# EAGLE design controller_board (EAGLE 9.4.0)
Assembly variants: Minimal, FullAwesome
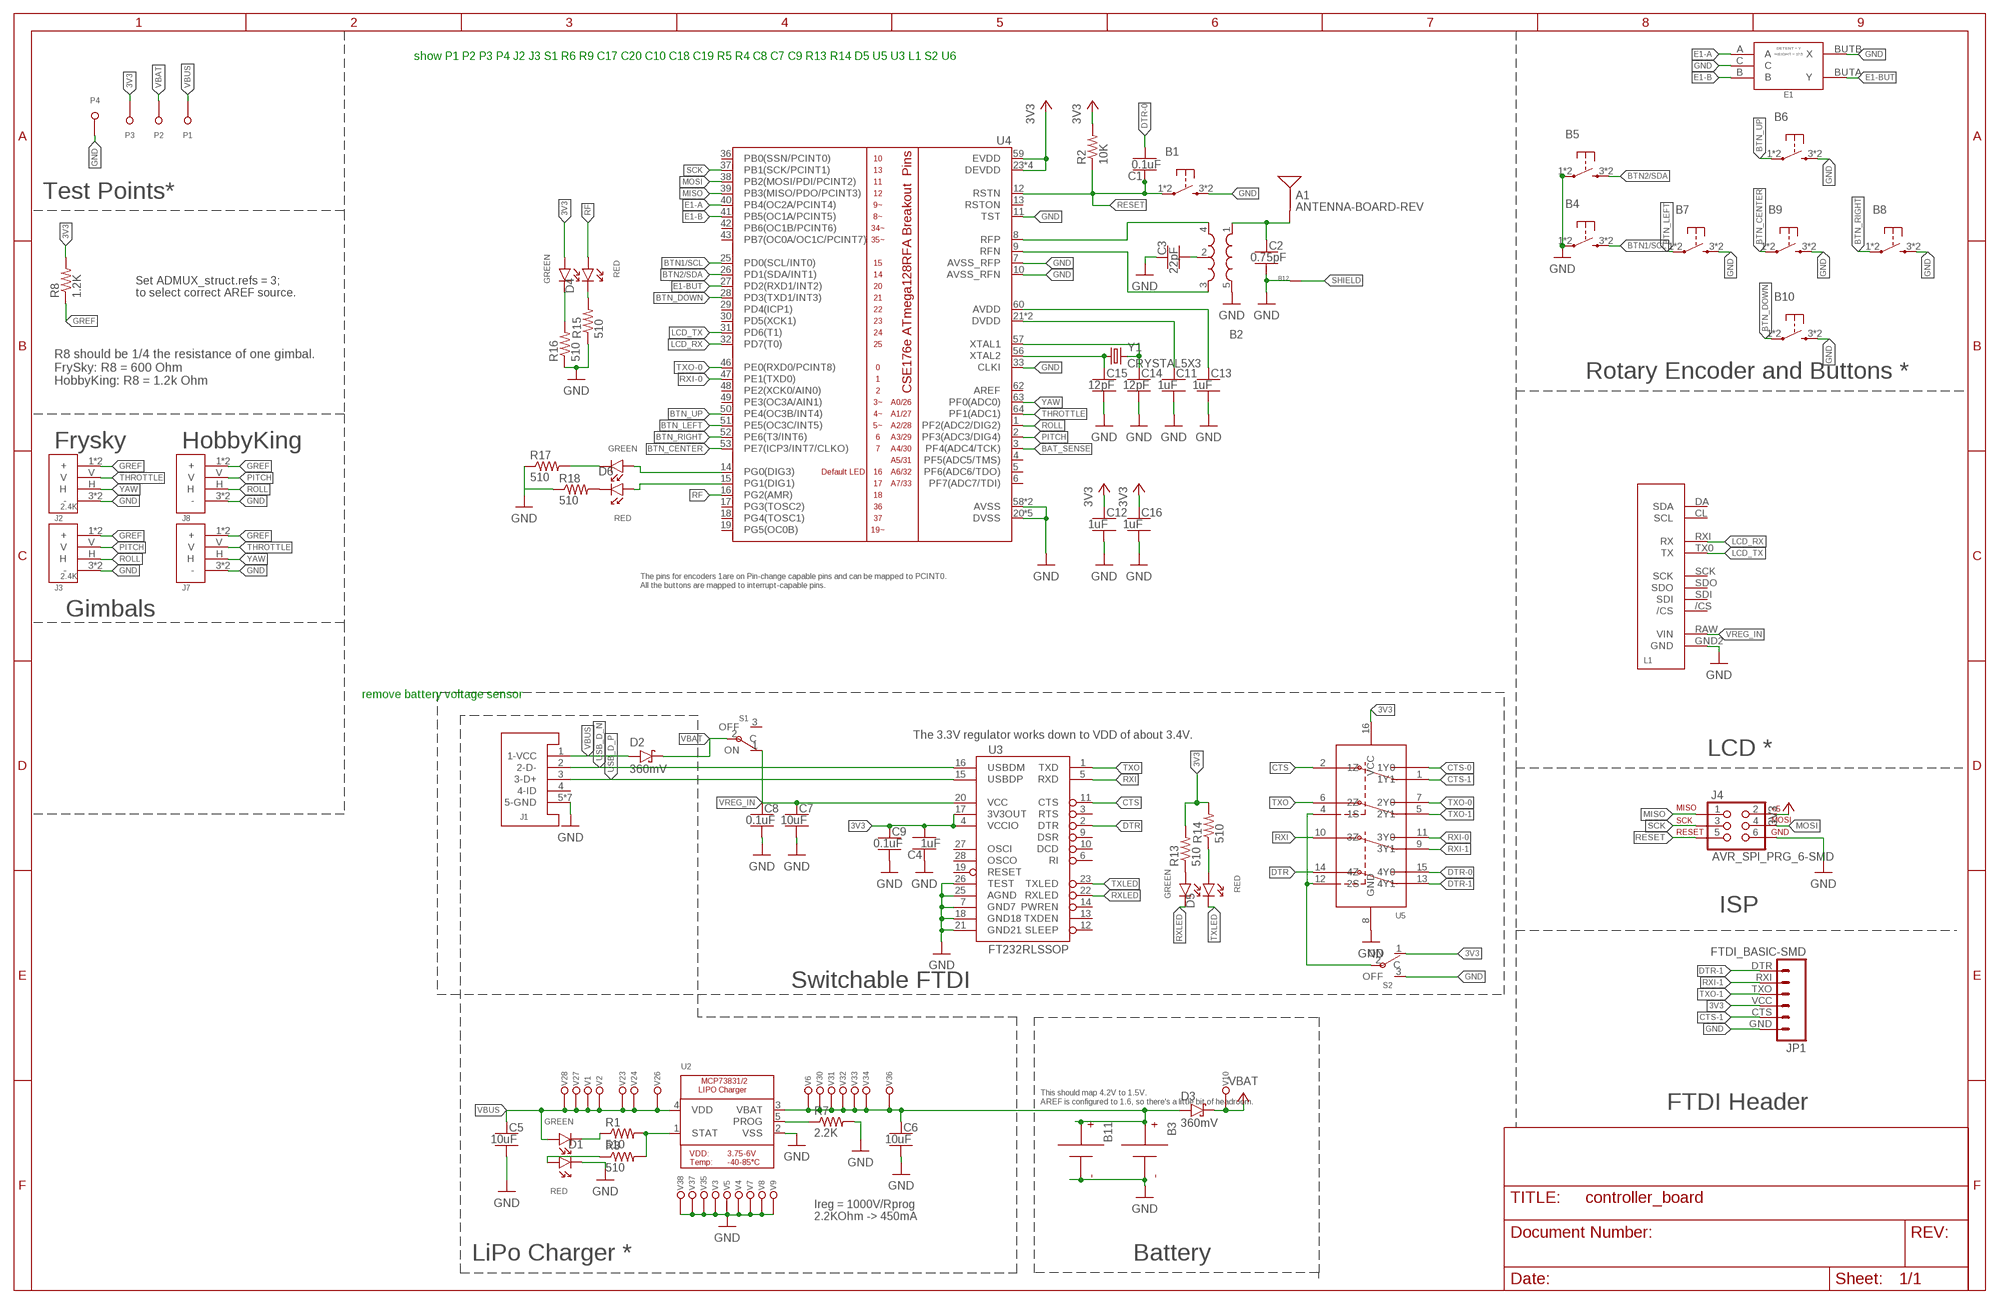
[diagram p0: schematic, sheet 1]
FRAME1 (FRAME_B_L): CREATOR: Unknown; DIST: Unknown; DISTPN: Unknown

## Parts
A1  ANTENNA-BOARD-REV  [ANT_PCB_2.4GHZ_NRF8001_1.6MM_1OZ_REV]
B1  PUSHBUTTON_-4.5X4.5  [4.5MM_TACTILE_SWITCH_TL3305AF160QG]
B2  BALUN0805  [BALUN]
B3  BATTERY-SPRING-SMD  [WIRE-TERMINAL-1X2-2.5MM-SMD-AVX-009276002021106]
B4  PUSHBUTTON_-4.5X4.5  [4.5MM_TACTILE_SWITCH_TL3305AF160QG]  (not fitted in variant Minimal)
B5  PUSHBUTTON_-4.5X4.5  [4.5MM_TACTILE_SWITCH_TL3305AF160QG]  (not fitted in variant Minimal)
B6  PUSHBUTTON_-4.5X4.5  [4.5MM_TACTILE_SWITCH_TL3305AF160QG]
B7  PUSHBUTTON_-4.5X4.5  [4.5MM_TACTILE_SWITCH_TL3305AF160QG]
B8  PUSHBUTTON_-4.5X4.5  [4.5MM_TACTILE_SWITCH_TL3305AF160QG]
B9  PUSHBUTTON_-4.5X4.5  [4.5MM_TACTILE_SWITCH_TL3305AF160QG]
B10  PUSHBUTTON_-4.5X4.5  [4.5MM_TACTILE_SWITCH_TL3305AF160QG]
B11  BATTERY-SCREW-TERMINAL  [SCREW-TERMINAL-1X2-2.54MM]
B12  NET_BRIDGE  [NET_BRIDGE]
C1  0.1uF  CAPACITOR-NP_SMD-2012-0805_CERAMIC-0.1UF  [CAPC2012X140_HS]
C2  0.75pF  CAPACITOR-NP_SMD-2012-0805_CERAMIC-0.75PF  [CAPC2012X140_HS]
C3  22pF  CAPACITOR-NP_SMD-2012-0805_CERAMIC-22PF  [CAPC2012X140_HS]
C4  1uF  CAPACITOR-NP_SMD-2012-0805_CERAMIC-1UF  [CAPC2012X140_HS]
C5  10uF  CAPACITOR-NP_SMD-2012-0805_CERAMIC-10UF  [CAPC2012X140_HS]
C6  10uF  CAPACITOR-NP_SMD-2012-0805_CERAMIC-10UF  [CAPC2012X140_HS]
C7  10uF  CAPACITOR-NP_SMD-2012-0805_CERAMIC-10UF  [CAPC2012X140_HS]  (not fitted in variant Minimal)
C8  0.1uF  CAPACITOR-NP_SMD-2012-0805_CERAMIC-0.1UF  [CAPC2012X140_HS]  (not fitted in variant Minimal)
C9  0.1uF  CAPACITOR-NP_SMD-2012-0805_CERAMIC-0.1UF  [CAPC2012X140_HS]  (not fitted in variant Minimal)
C11  1uF  CAPACITOR-NP_SMD-2012-0805_CERAMIC-1UF  [CAPC2012X140_HS]
C12  1uF  CAPACITOR-NP_SMD-2012-0805_CERAMIC-1UF  [CAPC2012X140_HS]
C13  1uF  CAPACITOR-NP_SMD-2012-0805_CERAMIC-1UF  [CAPC2012X140_HS]
C14  12pF  CAPACITOR-NP_SMD-2012-0805_CERAMIC-12PF  [CAPC2012X140_HS]
C15  12pF  CAPACITOR-NP_SMD-2012-0805_CERAMIC-12PF  [CAPC2012X140_HS]
C16  1uF  CAPACITOR-NP_SMD-2012-0805_CERAMIC-1UF  [CAPC2012X140_HS]
D1  LED-2X-GREEN/RED  [LED-2X-LTST-C155]
D2  360mV  DIODE-SCHOTTKY_SMD-SOD123-360MV  [SOD3716X135_HS]
D3  360mV  DIODE-SCHOTTKY_SMD-SOD123-360MV  [SOD3716X135_HS]
D4  LED-2X-GREEN/RED  [LED-2X-LTST-C155]
D5  LED-2X-GREEN/RED  [LED-2X-LTST-C155]  (not fitted in variant Minimal)
D6  LED-2X-GREEN/RED  [LED-2X-LTST-C155]
E1  ROTARY-ENCODER-W/BUTTON-BOURNS-PEC12R-4217F  [BOURNS-PEC12R]
J1  USB-MICROA-AMPHENOL-10118192-0001LF  [USB-MICROA-10118192-0001LF]  (not fitted in variant Minimal)
J2  2.4K  FRSKY-GIMBAL-FRYSKY  [JST-13-PTH]  (not fitted in variant Minimal)
J3  2.4K  FRSKY-GIMBAL-FRYSKY  [JST-13-PTH]  (not fitted in variant Minimal)
J4  AVR_SPI_PRG_6-SMD  [2X3-SMD]
J7  FRSKY-GIMBAL-2X-SERVO-SMD  [2X-SERVO-SMD]
J8  FRSKY-GIMBAL-2X-SERVO-SMD  [2X-SERVO-SMD]
JP1  FTDI_BASIC-SMD  [FTDI-BASIC-SMD]
L1  SPARKFUN_SERLCD_SERIAL_REDUCED-SMD  [SPARKFUN_SERLCD_16X2_REDUCED_SMD]
P1  TEST-POINT  [TEST-POINT-KEYSTONE-5000]  (not fitted in variant Minimal)
P2  TEST-POINT  [TEST-POINT-KEYSTONE-5000]  (not fitted in variant Minimal)
P3  TEST-POINT  [TEST-POINT-KEYSTONE-5000]  (not fitted in variant Minimal)
P4  TEST-POINT  [TEST-POINT-KEYSTONE-5000]  (not fitted in variant Minimal)
R1  510  RESISTOR_SMD-2012-0805-510  [RESC2012X60_HS]
R2  10K  RESISTOR_SMD-2012-0805-10K  [RESC2012X60_HS]
R3  510  RESISTOR_SMD-2012-0805-510  [RESC2012X60_HS]
R7  2.2K  RESISTOR_SMD-2012-0805-2.2K  [RESC2012X60_HS]
R8  1.2K  RESISTOR_SMD-2012-0805-1.2K  [RESC2012X60_HS]  (not fitted in variant Minimal)
R13  510  RESISTOR_SMD-2012-0805-510  [RESC2012X60_HS]  (not fitted in variant Minimal)
R14  510  RESISTOR_SMD-2012-0805-510  [RESC2012X60_HS]
R15  510  RESISTOR_SMD-2012-0805-510  [RESC2012X60_HS]
R16  510  RESISTOR_SMD-2012-0805-510  [RESC2012X60_HS]
R17  510  RESISTOR_SMD-2012-0805-510  [RESC2012X60_HS]
R18  510  RESISTOR_SMD-2012-0805-510  [RESC2012X60_HS]
S1  POWER-SWITCH-MFS201N-9-Z-SMD-VERTICAL  [JS102011JCQN]  (not fitted in variant Minimal)
S2  POWER-SWITCH-MFS201N-9-Z-SMD-VERTICAL  [JS102011JCQN]  (not fitted in variant Minimal)
U2  MCP73831T-2ACI/OT  MCP73831/2  [SOT23-5]
U3  FT232RLSSOP  [SSOP28DB]  (not fitted in variant Minimal)
U4  ATMEGA128RFA1  [QFN-64]
U5  DPDT-X2  [SOP65P640X110-16]  (not fitted in variant Minimal)
V1  LOCKED-VIA-0.2  [VIA-0.2MM]
V2  LOCKED-VIA-0.2  [VIA-0.2MM]
V3  LOCKED-VIA-0.2  [VIA-0.2MM]
V4  LOCKED-VIA-0.2  [VIA-0.2MM]
V5  LOCKED-VIA-0.2  [VIA-0.2MM]
V6  LOCKED-VIA-0.2  [VIA-0.2MM]
V7  LOCKED-VIA-0.2  [VIA-0.2MM]
V8  LOCKED-VIA-0.2  [VIA-0.2MM]
V9  LOCKED-VIA-0.2  [VIA-0.2MM]
V10  LOCKED-VIA-0.2  [VIA-0.2MM]
V23  LOCKED-VIA-0.2  [VIA-0.2MM]
V24  LOCKED-VIA-0.2  [VIA-0.2MM]
V26  LOCKED-VIA-0.2  [VIA-0.2MM]
V27  LOCKED-VIA-0.2  [VIA-0.2MM]
V28  LOCKED-VIA-0.2  [VIA-0.2MM]
V30  LOCKED-VIA-0.2  [VIA-0.2MM]
V31  LOCKED-VIA-0.2  [VIA-0.2MM]
V32  LOCKED-VIA-0.2  [VIA-0.2MM]
V33  LOCKED-VIA-0.2  [VIA-0.2MM]
V34  LOCKED-VIA-0.2  [VIA-0.2MM]
V35  LOCKED-VIA-0.2  [VIA-0.2MM]
V36  LOCKED-VIA-0.2  [VIA-0.2MM]
V37  LOCKED-VIA-0.2  [VIA-0.2MM]
V38  LOCKED-VIA-0.2  [VIA-0.2MM]
Y1  CRYSTAL5X3  [CRYSTAL-SMD-5X3]

## Nets
3V3 [HIGH-I]: C4.2 C9.1 C12.1 C16.1 D4.A2 J4.2 JP1.VCC P3.T R2.2 R8.2 R13.2 R14.2 S2.1(ON) U3.4(VCCIO) U3.17(3V3OUT) U4.23(DEVDD) U4.34(DEVDD) U4.44(DEVDD) U4.54(DEVDD) U4.59(EVDD) U5.16(VCC)
ANTENNA [RFSIG]: A1.FEED(SIGNAL) B2.1(IN) C2.1
BAT_SENSE: U4.3(PF4(ADC4/TCK))
BCAP [HIGH-I]: B2.2(GND) C3.2
BPOS [PWR]: B3.1A(P) B3.1B(P) B11.2(P) C6.1 D3.A U2.3(VBAT) V6.P1(N) V30.P1(N) V31.P1(N) V32.P1(N) V33.P1(N) V34.P1(N) V36.P1(N)
BTN1/SCL: B4.3 B4.4 U4.25(PD0(SCL/INT0))
BTN2/SDA: B5.3 B5.4 U4.26(PD1(SDA/INT1))
BTN_CENTER: B9.1 B9.2 U4.53(PE7(ICP3/INT7/CLKO))
BTN_DOWN: B10.1 B10.2 U4.28(PD3(TXD1/INT3))
BTN_LEFT: B7.1 B7.2 U4.51(PE5(OC3C/INT5))
BTN_RIGHT: B8.1 B8.2 U4.52(PE6(T3/INT6))
BTN_UP: B6.1 B6.2 U4.50(PE4(OC3B/INT4))
CLK_NEG: C15.1 U4.56(XTAL2) Y1.1
CLK_POS: C14.1 U4.57(XTAL1) Y1.3
CTS: U3.11(CTS) U5.2(1Z)
CTS-0: U5.3(1Y0)
CTS-1: JP1.CTS U5.1(1Y1)
DTR: U3.2(DTR) U5.14(4Z)
DTR-0: C1.2 U5.15(4Y0)
DTR-1: JP1.DTR U5.13(4Y1)
E1-A: E1.A U4.40(PB4(OC2A/PCINT4))
E1-B: E1.B U4.41(PB5(OC1A/PCINT5))
E1-BUT: E1.BUTA(Y) U4.27(PD2(RXD1/INT2))
GND: B1.3 B1.4 B2.5(GND) B3.2A(N) B3.2B(N) B4.1 B4.2 B5.1 B5.2 B6.3 B6.4 B7.3 B7.4 B8.3 B8.4 B9.3 B9.4 B10.3 B10.4 B11.1(N) B12.P1 C2.2 C3.1 C4.1 C5.2 C6.2 C7.2 C8.2 C9.2 C11.2 C12.2 C13.2 C14.2 C15.2 C16.2 D1.C1 E1.BUTB(X) E1.C J1.5(5-GND) J1.6(5-GND) J1.7(5-GND) J1.8(5-GND) J1.9(5-GND) J1.10(5-GND) J1.11(5-GND) J2.3(-) J2.6(-) J3.3(-) J3.6(-) J4.6 J7.3(-) J7.6(-) J8.3(-) J8.6(-) JP1.GND L1.GND2(GND) P4.T R7.2 R15.1 R16.1 R17.1 R18.1 S2.3(OFF) U2.2(VSS) U3.7(GND7) U3.18(GND18) U3.21(GND21) U3.25(AGND) U3.26(TEST) U4.7(AVSS_RFP) U4.10(AVSS_RFN) U4.11(TST) U4.20(DVSS) U4.24(DVSS) U4.33(CLKI) U4.35(DVSS) U4.45(DVSS) U4.55(DVSS) U4.58(AVSS) U4.61(AVSS) U5.8(GND) V3.P1(N) V4.P1(N) V5.P1(N) V7.P1(N) V8.P1(N) V9.P1(N) V35.P1(N) V37.P1(N) V38.P1(N)
GREF: J2.1(+) J2.4(+) J3.1(+) J3.4(+) J7.1(+) J7.4(+) J8.1(+) J8.4(+) R8.1
LCD_RX: L1.RXI(RX) U4.32(PD7(T0))
LCD_TX: L1.TX0(TX) U4.31(PD6(T1))
MISO: J4.1 U4.39(PB3(MISO/PDO/PCINT3))
MOSI: J4.4 U4.38(PB2(MOSI/PDI/PCINT2))
N$1: D1.A1 R3.1
N$2: D1.C2 R1.1
N$3: D5.A1 R14.1
N$4: D6.C2 R17.2
N$6: D4.C1 R15.2
N$8: D6.A2 U4.14(PG0(DIG3))
N$9: D6.A1 U4.15(PG1(DIG1))
N$11: R1.2 R3.2 U2.1(STAT)
N$12: R7.1 U2.5(PROG)
N$13: D4.C2 R16.2
N$14: D5.A2 R13.1
N$20: C11.1 U4.21(DVDD) U4.22(DVDD)
N$21: C13.1 U4.60(AVDD)
N$30: D6.C1 R18.2
PITCH: J3.V J8.V U4.2(PF3(ADC3/DIG4))
PROG_SEL: S2.2(C) U5.4(1S) U5.12(2S)
RESET: B1.1 B1.2 C1.1 J4.5 R2.1 U4.12(RSTN)
RF: D4.A1 U4.16(PG2(AMR))
RF_N: B2.3(OUT2) U4.9(RFN)
RF_P: B2.4(OUT1) U4.8(RFP)
ROLL: J3.H J8.H U4.1(PF2(ADC2/DIG2))
RXI: U3.5(RXD) U5.10(3Z)
RXI-0: U4.47(PE1(TXD0)) U5.11(3Y0)
RXI-1: JP1.RXI U5.9(3Y1)
RXLED: D5.C2 U3.22(RXLED)
SCK: J4.3 U4.37(PB1(SCK/PCINT1))
SHIELD: B12.P2
THROTTLE: J2.V J7.V U4.64(PF1(ADC1))
TXLED: D5.C1 U3.23(TXLED)
TXO: U3.1(TXD) U5.6(2Z)
TXO-0: U4.46(PE0(RXD0/PCINT8)) U5.7(2Y0)
TXO-1: JP1.TXO U5.5(2Y1)
USB_D_N: J1.2(2-D-) U3.16(USBDM)
USB_D_P: J1.3(3-D+) U3.15(USBDP)
VBAT [PWR]: D2.C D3.C P2.T S1.2(C) V10.P1(N)
VBUS [PWR]: C5.1 D1.A2 D2.A J1.1(1-VCC) P1.T U2.4(VDD) V1.P1(N) V2.P1(N) V23.P1(N) V24.P1(N) V26.P1(N) V27.P1(N) V28.P1(N)
VREG_IN [PWR]: C7.1 C8.1 L1.RAW(VIN) S1.1(ON) U3.20(VCC)
YAW: J2.H J7.H U4.63(PF0(ADC0))
Unconnected: J1.4(4-ID) L1./CS L1.CL(SCL) L1.DA(SDA) L1.SCK L1.SDI L1.SDO S1.3(OFF) U3.3(RTS) U3.6(RI) U3.9(DSR) U3.10(DCD) U3.12(SLEEP) U3.13(TXDEN) U3.14(PWREN) U3.19(RESET) U3.27(OSCI) U3.28(OSCO) U4.4(PF5(ADC5/TMS)) U4.5(PF6(ADC6/TDO)) U4.6(PF7(ADC7/TDI)) U4.13(RSTON) U4.17(PG3(TOSC2)) U4.18(PG4(TOSC1)) U4.19(PG5(OC0B)) U4.29(PD4(ICP1)) U4.30(PD5(XCK1)) U4.36(PB0(SSN/PCINT0)) U4.42(PB6(OC1B/PCINT6)) U4.43(PB7(OC0A/OC1C/PCINT7)) U4.48(PE2(XCK0/AIN0)) U4.49(PE3(OC3A/AIN1)) U4.62(AREF)

## Notes on the sheet
- show P1 P2 P3 P4 J2 J3 S1 R6 R9 C17 C20 C10 C18 C19 R5 R4 C8 C7 C9 R13 R14 D5 U5 U3 L1 S2 U6
- Test Points*
- Set ADMUX_struct.refs = 3;
  to select correct AREF source.
- Rotary Encoder and Buttons *
- R8 should be 1/4 the resistance of one gimbal.
  FrySky: R8 = 600 Ohm
  HobbyKing: R8 = 1.2k Ohm
- Frysky | HobbyKing
- The pins for encoders 1are on Pin-change capable pins and can be mapped to PCINT0.
  All the buttons are mapped to interrupt-capable pins.
- Gimbals
- remove battery voltage sensor
- The 3.3V regulator works down to VDD of about 3.4V.
- LCD *
- ISP
- Switchable FTDI
- This should map 4.2V to 1.5V.
  AREF is configured to 1.6, so there's a little bit of headroom.
- FTDI Header
- Ireg = 1000V/Rprog
  2.2KOhm -> 450mA
- LiPo Charger * | Battery

## Library data of the parts
A1 = quadparts_prebuilt:ANTENNA: Single endded antenna.; CREATOR: Swanson; DIST: NA; DISTPN: NA; MOUNTING: NONE
B1 B4-B10 = quadparts_prebuilt:PUSHBUTTON_: "Tactile" or "clicky" button.; CREATOR: Swanson; DIST: DIGIKEY; DISTPN: EG5350CT-ND; MOUNTING: SMD
B2 = quadparts_prebuilt:BALUN: A balun to convert differential radio-frequency outputs from the microcontroller into a single-ended driver for the antenna.; CREATOR: Swanson; DATASHEET: http://katalog.we-online.de/pbs/datasheet/748421245.pdf; DIST: Digikey; DISTPN: 732-2230-1-ND; MFR: Wurth Electronics Inc; MOUNTING: SMD; MPN: 748421245; PRICE: 2.63; REVIEWER: Swanson
B3 = quadparts_prebuilt:BATTERY: Connections for a battery.; DIST: DIGIKEY; DISTPN: 478-6169-1-ND; MOUNTING: SMD; PIN1: +; PIN2: -
B11 = quadparts_prebuilt:BATTERY: Connections for a battery.; CREATOR: Swanson; DIST: DIGIKEY; DISTPN: ED10561-ND; MOUNTING: TH; PIN1: -; PIN2: +
B12 = custom:NET_BRIDGE; CREATOR: Michael Gonzalez; DIST: NA; DISTPN: NA
C1 C8 C9 = quadparts_prebuilt:CAPACITOR-NP_: Nonpolarized capacitor; CREATOR: Swanson; DIST: Digikey; DISTPN: 445-1418-1-ND; MFR: TDK; MOUNTING: SMD; MPN: C2012X7R2A104K125AA; REVIEWER: Swanson
C2 = quadparts_prebuilt:CAPACITOR-NP_: Nonpolarized capacitor; CREATOR: Swanson; DIST: Digikey; DISTPN: 490-3585-1-ND; MFR: Murata Electronics North America; MOUNTING: SMD; MPN: GQM2195C2AR75CB01D; REVIEWER: Swanson
C3 = quadparts_prebuilt:CAPACITOR-NP_: Nonpolarized capacitor; CREATOR: Swanson; DIST: Digikey; DISTPN: 490-5534-1-ND; MFR: Murata Electronics North America; MOUNTING: SMD; MPN: GRM21A5C2E220JW01D; REVIEWER: Swanson
C4 C11-C13 C16 = quadparts_prebuilt:CAPACITOR-NP_: Nonpolarized capacitor; CREATOR: Swanson; DIST: Digikey; DISTPN: 587-1281-1-ND; MFR: Taiyo Yuden; MOUNTING: SMD; MPN: TMK212B7105KG-T; REVIEWER: Swanson
C5-C7 = quadparts_prebuilt:CAPACITOR-NP_: Nonpolarized capacitor; CREATOR: Swanson; DIST: Digikey; DISTPN: 445-5984-1-ND; MOUNTING: SMD; REVIEWER: Swanson
C14 C15 = quadparts_prebuilt:CAPACITOR-NP_: Nonpolarized capacitor; CREATOR: Swanson; DIST: Digikey; DISTPN: 490-5531-1-ND; MFR: Murata Electronics North America; MOUNTING: SMD; MPN: GRM21A5C2E120JW01D; REVIEWER: Swanson
D1 D4-D6 = RemoteParts:LED-2X; COLOR1: GREEN; COLOR2: RED; CREATOR: Swanson; DIST: DIGIKEY; DISTPN: 160-1172-1-ND; MOUNTING: SMD
D2 D3 = quadparts_prebuilt:DIODE-SCHOTTKY_: Schottky diode; CREATOR: Swanson; DIST: Digikey; DISTPN: CRS08QMCT-ND; MFR: Toshiba Semiconductor and Storage; MOUNTING: SMD; MPN: CRS08(TE85L,Q,M); REVIEWER: Swanson
E1 = RemoteParts:ROTARY-ENCODER-W/BUTTON; AUX1DIST: DIGIKEY; AUX1DISTPN: 1722-1241-ND; CREATOR: Swanson; DETENT: Y; DIST: DIGIKEY; DISTPN: PEC12R-4217F-S0024-ND; HEIGHT: 17.5; MOUNTING: TH
J1 = RemoteParts:USB; CREATOR: Swanson; DIST: DIGIKEY; DISTPN: 609-4613-1-ND; MOUNTING: SMD
J2 = RemoteParts:FRSKY-GIMBAL; CREATOR: Swanson; DIST: Digikey; DISTPN: A100106-ND; MOUNTING: TH
J3 = RemoteParts:FRSKY-GIMBAL; CREATOR: Swanson; DIST: Digikey; DISTPN: A100106-ND; MOUNTING: TH; SPICEPREFIX: E
J4 = quadparts_prebuilt:AVR_SPI_PRG_6: AVR ISP 6 Pin This is the in-system programming (ISP) connector for Atmel Microcontrollers programming.; CREATOR: Swanson; DIST: Digikey; DISTPN: 952-1922-ND; MOUNTING: SMD
J7 J8 = RemoteParts:FRSKY-GIMBAL
JP1 = quadparts_prebuilt:FTDI_BASIC: FTDI (USB-serial converter) header bins with labels.; DIST: DIGIKEY; DISTPN: 952-3235-ND; MOUNTING: SMD
L1 = RemoteParts:SPARKFUN_SERLCD_SERIAL_REDUCED; AUX1DIST: DIGIKEY; AUX1DISTPN: 952-1842-ND; AUX2DIST: Digikey; AUX2DISTPN: S5641-ND; CREATOR: Swanson; DIST: Sparkfun; DISTPN: LCD-14072
P1-P4 = RemoteParts:TEST-POINT; CREATOR: Swanson; DIST: DIGIKEY; DISTPN: 36-5001-ND; MOUNTING: TH
R1 R3 R13-R18 = quadparts_prebuilt:RESISTOR_: Resistor; CREATOR: SWANSON; DIST: DIGIKEY; DISTPN: 311-510ARCT-ND; MOUNTING: SMD
R2 = quadparts_prebuilt:RESISTOR_: Resistor; CREATOR: Swanson; DIST: Digikey; DISTPN: 311-10KARCT-ND; MFR: Yageo; MOUNTING: SMD; MPN: RC0805JR-0710KL; REVIEWER: Swanson
R7 = quadparts_prebuilt:RESISTOR_: Resistor; CREATOR: SWANSON; DIST: DIGIKEY; DISTPN: YAG3776CT-ND; MOUNTING: SMD
R8 = quadparts_prebuilt:RESISTOR_: Resistor; CREATOR: Swanson; DIST: DIGIKEY; DISTPN: 311-1.20KCRCT-ND; MOUNTING: SMD
S1 S2 = RemoteParts:POWER-SWITCH-MFS201N-9-Z; CREATOR: Swanson; DIST: DIGIKEY; DISTPN: CKN10721CT-ND; MOUNTING: SMD
U2 = RemoteParts:MCP73831/2: MCP73831/2 LIPO Charger VDD: 3.75 - 6V Temp -40 - 85°C Programmable Charge Rate: 15-500mA NOTE: STAT is a tri-state logic output on the MCP73831 and an open-drain output on the MCP73832. SOT23-5 with 4.2V output and tri-state logic on STAT = MCP73831T-2ACI/OT; CREATOR: Adafruit; DIST: DIGIKEY; DISTPN: MCP73831T-2ACI/OTCT-ND; MOUNTING: SMD
U3 = RemoteParts:FT232RL: USB UART FT232RL 4th Generation USB UART (USB <-> Serial) Controller. Spark Fun Electronics SKU : COM-00650; CREATOR: Swanson; DIST: DIGIKEY; DISTPN: 768-1007-1-ND; MOUNTING: SMD
U4 = quadparts_prebuilt:ATMEGA128RFA1: ATmega128RFA1 8-bit AVR Microcontroller with Low Power 2.4GHz Transceiver for ZigBee and IEEE 802.15.4; CREATOR: Swanson; DATASHEET: http://www.atmel.com/Images/Atmel-8266-MCU_Wireless-ATmega128RFA1_Datasheet.pdf; DIST: Digikey; DISTPN: ATMEGA128RFA1-ZU-ND; MFR: Atmel; MOUNTING: SMD; MPN: ATMEGA128RFA1-ZUR00; PRICE: 10.21; REVIEWER: Swanson
U5 = RemoteParts:DPDT-X2; CREATOR: Swanson; DIST: DIGIKEY; DISTPN: 568-5300-1-ND; MOUNTING: SMD
V1-V10 V23 V24 V26-V28 V30-V38 = quadparts_prebuilt:LOCKED-VIA: A via that be removed via ripup.; CREATOR: Swanson; DIST: NA; DISTPN: NA; MOUNTING: NONE
Y1 = quadparts_prebuilt:CRYSTAL: Crystals to provide clock references for microcontrollers, etc.; CREATOR: Swanson; DATASHEET: http://www.abracon.com/Resonators/abm3b.pdf; DIST: Digikey; DISTPN: 535-9122-1-ND; MFR: Abracon LLC; MOUNTING: SMD; MPN: ABM3B-16.000MHZ-B2-T; PRICE: 0.68; PROD_ID: XTAL-08218; REVIEWER: Swanson

## Net classes
1 HIGH-I: width 0.254 mm, drill 0.203 mm
2 RFSIG: width 1.27 mm
3 PWR: width 0.508 mm, drill 0.381 mm

## Board
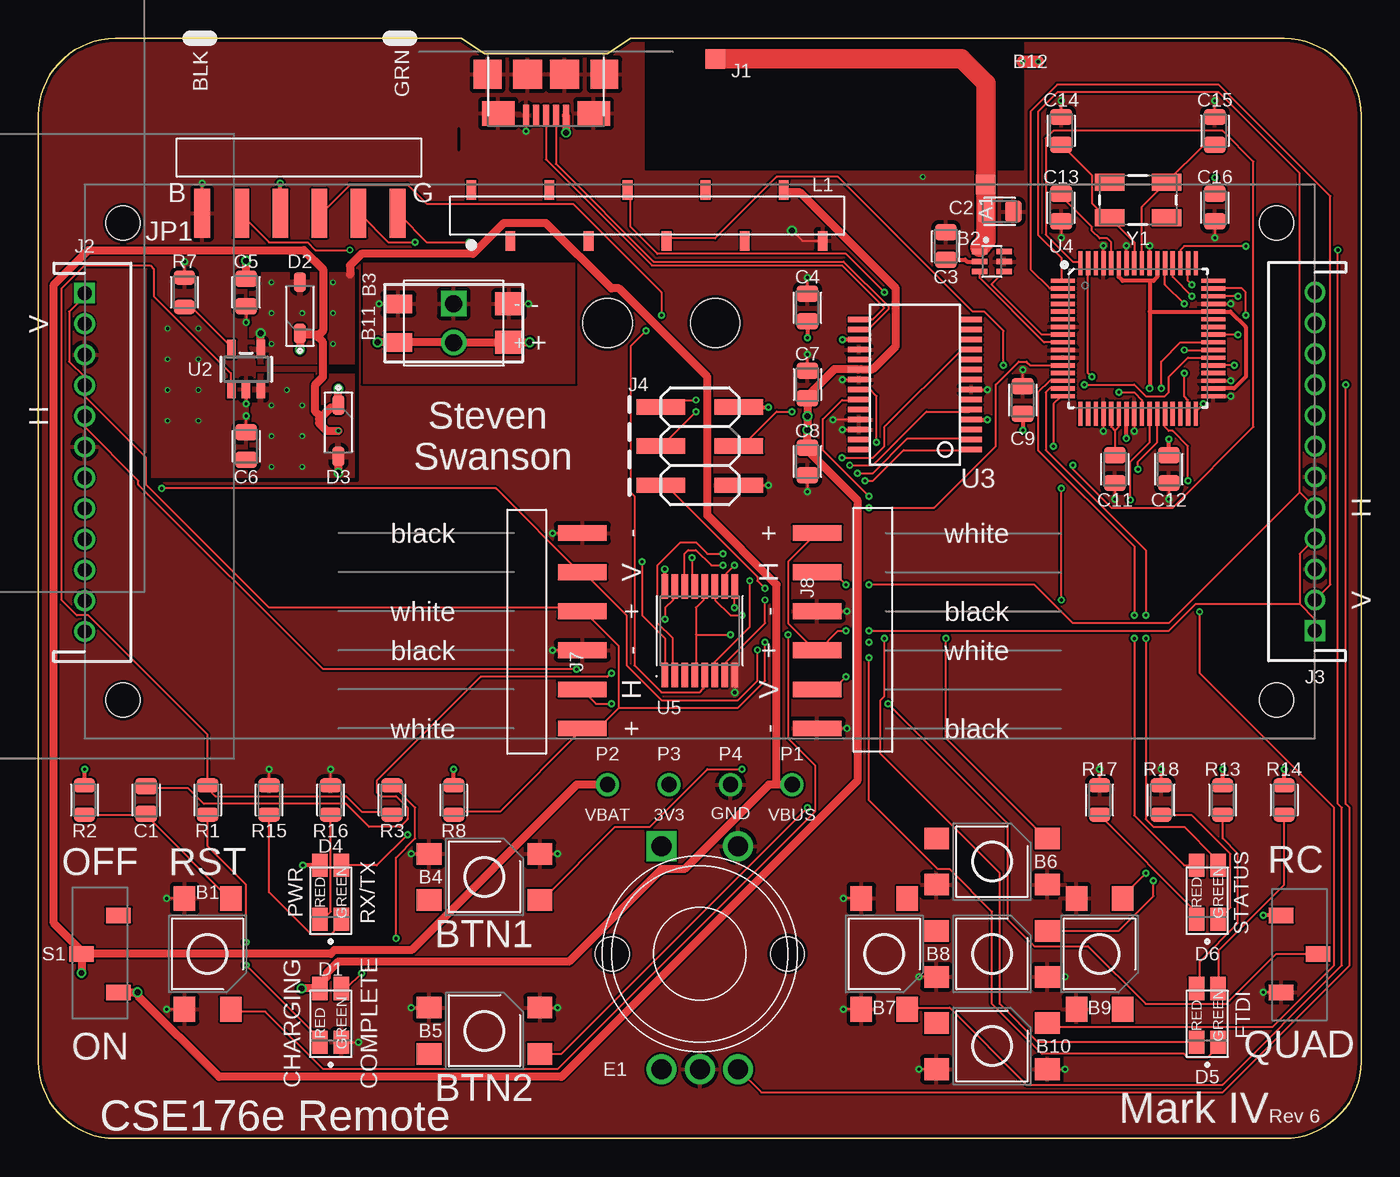
[diagram p1: board, top side]
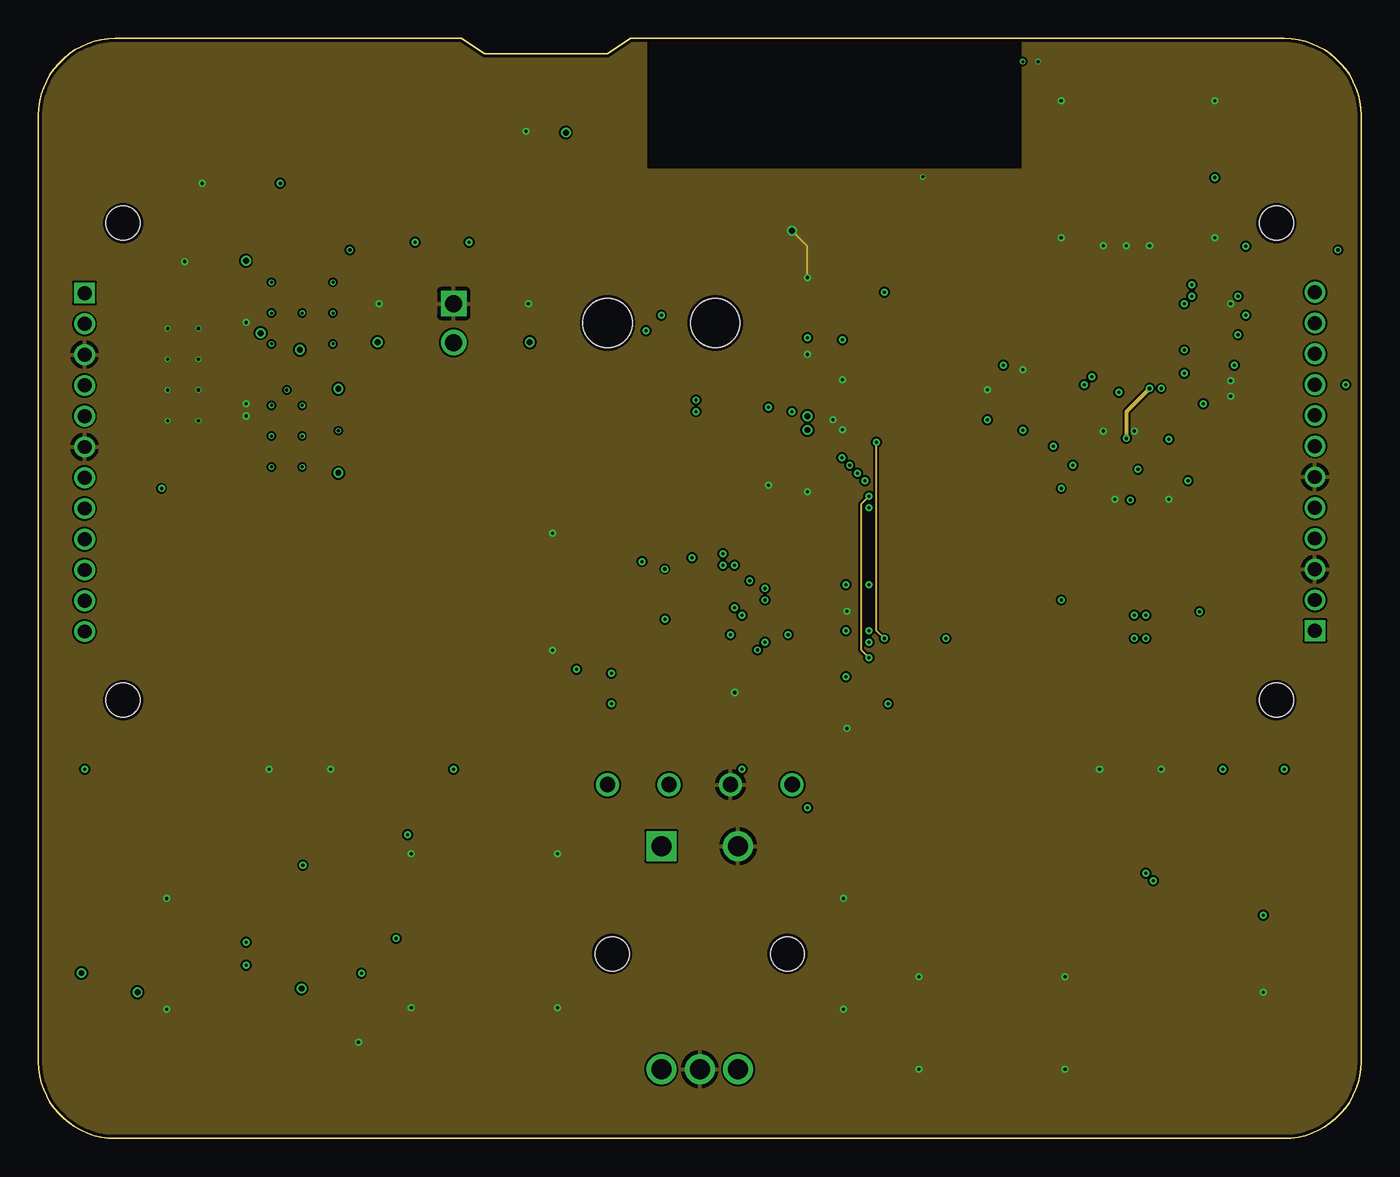
[diagram p2: board, inner layer Route2]
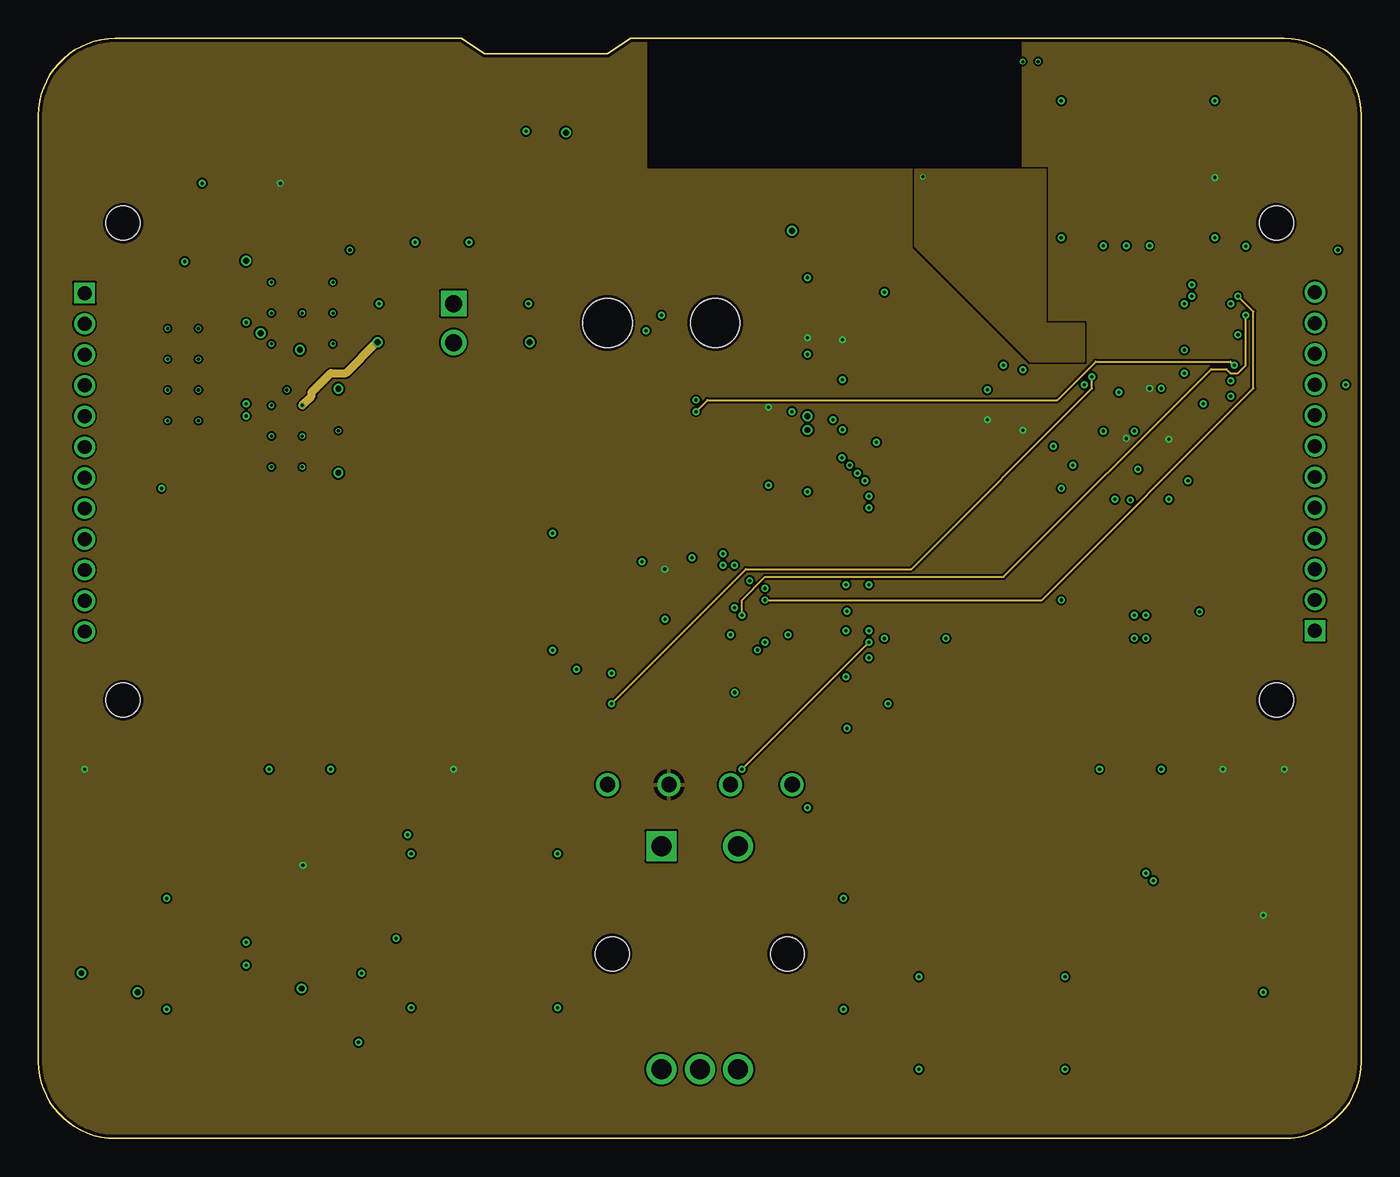
[diagram p3: board, inner layer Route15]
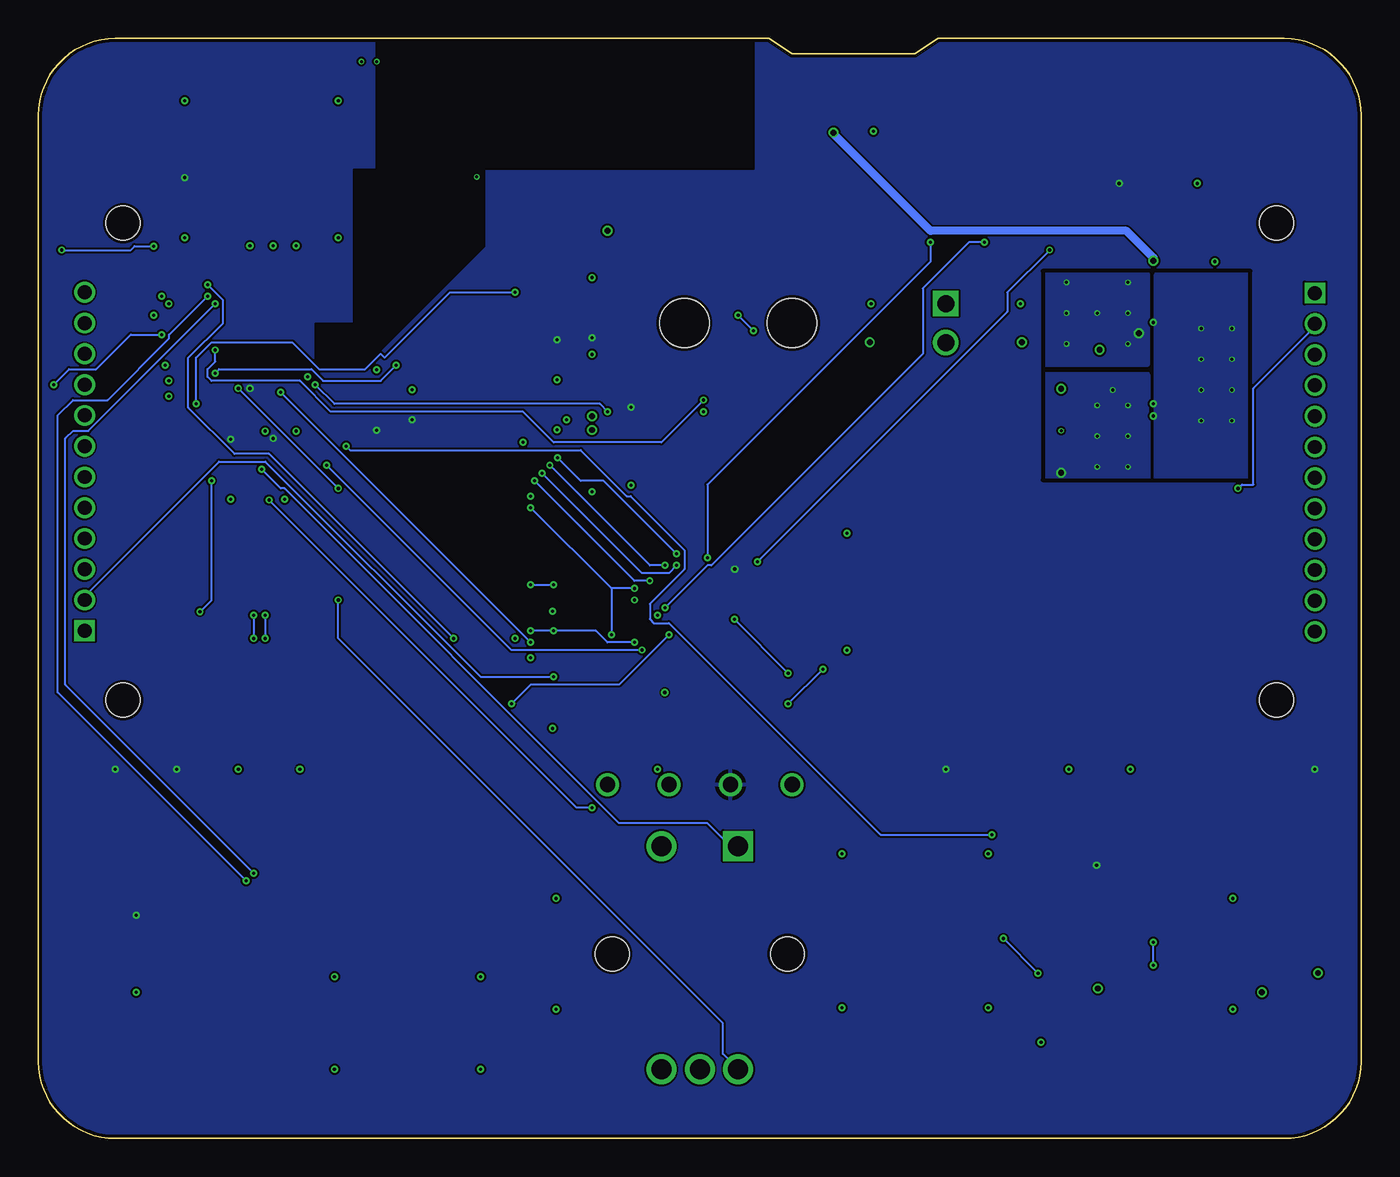
[diagram p4: board, bottom side, seen from below]

Size 86 x 71.5 mm. Coordinates in mm from the lower left corner, seen from the top.
Outline: 86,66.5 86,5 arc-90 81,0 5,0 arc-90 0,5 0,66.5 arc-90 5,71.5 27.5,71.5 29,70.5 37,70.5 38.5,71.5 81,71.5 arc-90 86,66.5
Copper layers (1*2*15*16): Top 0.035559375mm / dielectric 1.501140625mm / Route2 0.035559375mm / dielectric 0.149859375mm / Route15 0.035559375mm / dielectric 0.200659375mm / Bottom 0.035559375mm
Design rules "jlcpcb-4layer-5mil-small-cream": minimum track width 5mil, minimum drill 0.2mm, track to track 5mil, track to pad 5mil, pad to pad 5mil, via to via 5mil, smd to smd 5mil, copper to edge 0.2mm, drill to drill 10mil, minimum pad ring 3mil, minimum via ring 5mil, stop-mask expansion 3mil, vias tented up to drill 0.45mm, thermal gap 10mil
Holes 3.2 mm at 37,53 44,53
tRestrict: 8 lines
bRestrict: area 57,50.5 to 68,63; 8 lines

### Footprints (pad centres in the part's own frame; a part is rotated, then mirrored left to right if it is on the bottom)
ANT_PCB_2.4GHZ_NRF8001_1.6MM_1OZ_REV = smd 1.27 x 1.27: FEED 0,0; TESTPOINT 8.169,17.605
4.5MM_TACTILE_SWITCH_TL3305AF160QG = smd 1.6 x 1.4: 1 -3.6,-1.5; 2 3.6,-1.5; 3 -3.6,1.5; 4 3.6,1.5
BALUN = smd 0.35 x 1: 1 -0.65,-0.8; 2 0,-0.8; 3 0.65,-0.8; 4 0.65,0.8; 5 0,0.8; 6 -0.65,0.8
WIRE-TERMINAL-1X2-2.5MM-SMD-AVX-009276002021106 = smd 1.8 x 1.5: 1A 3.6,-1.25; 2A 3.6,1.25 | smd 1.8 x 1.2: 1B -3.6,-1.25; 2B -3.6,1.25
SCREW-TERMINAL-1X2-2.54MM = drill 1.1 square: 1 -1.27,0 | drill 1.1: 2 1.27,0
NET_BRIDGE = drill 0.2: P1 -0.5,0; P2 0.5,0
CAPC2012X140_HS = smd 1.08 x 1.42: 1 -0.895,0; 2 0.895,0
LED-2X-LTST-C155 = smd 1.5 x 1: A1 -1.75,0.7; A2 -1.75,-0.7; C1 1.75,0.7; C2 1.75,-0.7
SOD3716X135_HS = smd 1.25 x 0.8: A 1.665,0; C -1.665,0
BOURNS-PEC12R = drill 1.3: A -2.5,-7.5; B 2.5,-7.5; BUTB 2.5,7; C 0,-7.5 | drill 1.3 square: BUTA -2.5,7 | hole 2.2: -5.7,0; 5.7,0
FRSKY-TARANIS-GIMBAL = hole 2.2: -27,-27; -27,27; -27,27; 27,-27; 27,27
USB-MICROA-10118192-0001LF = smd 0.4 x 1.35: 1 -1.3,0; 2 -0.65,0; 3 0,0; 4 0.65,0; 5 1.3,0 | smd 2.1 x 1.6: 6 3.1,-0.125; 7 -3.1,-0.125 | smd 1.8 x 1.9: 8 -3.8,-2.675; 11 3.8,-2.675 | smd 1.9 x 1.9: 9 1.2,-2.675; 10 -1.2,-2.675
JST-13-PTH = drill 0.9 square: 1 -2,0 | drill 0.9: 3 2,0; 4 4,0; 6 8,0; 7 10,0; 8 12,0; 9 14,0; 10 16,0; 11 18,0; 12 20,0; H 6,0; V 0,0
2X3-SMD = smd 1 x 3.15: 1 -2.54,-2.54; 2 -2.54,2.54; 3 0,-2.54; 4 0,2.54; 5 2.54,-2.54; 6 2.54,2.54
2X-SERVO-SMD = smd 1.02 x 3.17: 1 -6.35,0.635; 3 -1.27,0.635; 4 1.27,0.635; 6 6.35,0.635; H -3.81,0.635; V 3.81,0.635
FTDI-BASIC-SMD = smd 1.02 x 3.17: CTS -3.81,0.635; DTR 6.35,0.635; GND -6.35,0.635; RXI 3.81,0.635; TXO 1.27,0.635; VCC -1.27,0.635
SPARKFUN_SERLCD_16X2_REDUCED_SMD = smd 0.635 x 1.27: /CS -7.24,14.336; CL 0.38,17.636; DA 2.92,14.336; GND2 8,14.336; RAW 5.46,17.636; RXI -4.7,17.636; SCK -14.86,17.636; SDI -9.78,17.636; SDO -12.32,14.336; TX0 -2.16,14.336 | hole 2.2: -37.5,-15.5; -37.5,15.5; 37.5,-15.5; 37.5,15.5
TEST-POINT-KEYSTONE-5000 = drill 1: T 0,0
RESC2012X60_HS = smd 0.92 x 1.38: 1 -0.955,0; 2 0.955,0
JS102011JCQN = smd 1 x 1.6: 1 -2.5,-1.2; 2 0,1.2; 3 2.5,-1.2
SOT23-5 = smd 0.55 x 1.2: 1 -0.95,-1.3; 2 0,-1.3; 3 0.95,-1.3; 4 0.95,1.3; 5 -0.95,1.3
SSOP28DB = smd 0.348 x 1.397: 1 -4.225,-3.656; 2 -3.575,-3.656; 3 -2.925,-3.656; 4 -2.275,-3.656; 5 -1.625,-3.656; 6 -0.975,-3.656; 7 -0.325,-3.656; 8 0.325,-3.656; 9 0.975,-3.656; 10 1.625,-3.656; 11 2.275,-3.656; 12 2.925,-3.656; 13 3.575,-3.656; 14 4.225,-3.656; 15 4.225,3.656; 16 3.575,3.656; 17 2.925,3.656; 18 2.275,3.656; 19 1.625,3.656; 20 0.975,3.656; 21 0.325,3.656; 22 -0.325,3.656; 23 -0.975,3.656; 24 -1.625,3.656; 25 -2.275,3.656; 26 -2.925,3.656; 27 -3.575,3.656; 28 -4.225,3.656
QFN-64 = smd 1.562 x 0.28: 1 -4.881,3.75; 2 -4.881,3.25; 3 -4.881,2.75; 4 -4.881,2.25; 5 -4.881,1.75; 6 -4.881,1.25; 7 -4.881,0.75; 8 -4.881,0.25; 9 -4.881,-0.25; 10 -4.881,-0.75; 11 -4.881,-1.25; 12 -4.881,-1.75; 13 -4.881,-2.25; 14 -4.881,-2.75; 15 -4.881,-3.25; 16 -4.881,-3.75; 33 4.881,-3.75; 34 4.881,-3.25; 35 4.881,-2.75; 36 4.881,-2.25; 37 4.881,-1.75; 38 4.881,-1.25; 39 4.881,-0.75; 40 4.881,-0.25; 41 4.881,0.25; 42 4.881,0.75; 43 4.881,1.25; 44 4.881,1.75; 45 4.881,2.25; 46 4.881,2.75; 47 4.881,3.25; 48 4.881,3.75 | smd 0.28 x 1.562: 17 -3.75,-4.881; 18 -3.25,-4.881; 19 -2.75,-4.881; 20 -2.25,-4.881; 21 -1.75,-4.881; 22 -1.25,-4.881; 23 -0.75,-4.881; 24 -0.25,-4.881; 25 0.25,-4.881; 26 0.75,-4.881; 27 1.25,-4.881; 28 1.75,-4.881; 29 2.25,-4.881; 30 2.75,-4.881; 31 3.25,-4.881; 32 3.75,-4.881; 49 3.75,4.881; 50 3.25,4.881; 51 2.75,4.881; 52 2.25,4.881; 53 1.75,4.881; 54 1.25,4.881; 55 0.75,4.881; 56 0.25,4.881; 57 -0.25,4.881; 58 -0.75,4.881; 59 -1.25,4.881; 60 -1.75,4.881; 61 -2.25,4.881; 62 -2.75,4.881; 63 -3.25,4.881; 64 -3.75,4.881
SOP65P640X110-16 = smd 1.572 x 0.407: 1 -2.872,2.275; 2 -2.872,1.625; 3 -2.872,0.975; 4 -2.872,0.325; 5 -2.872,-0.325; 6 -2.872,-0.975; 7 -2.872,-1.625; 8 -2.872,-2.275; 9 2.872,-2.275; 10 2.872,-1.625; 11 2.872,-0.975; 12 2.872,-0.325; 13 2.872,0.325; 14 2.872,0.975; 15 2.872,1.625; 16 2.872,2.275
VIA-0.2MM = drill 0.2 pad 0.3: P1 0,0
CRYSTAL-SMD-5X3 = smd 1.9 x 1.1: 1 -1.85,-1.15; 2 1.85,-1.15; 3 1.85,1.15; 4 -1.85,1.15

### Placement (x,y rotation side)
A1  61.6,62 90 top
B1  11,12 90 top
B2  62,57 270 top
B3  27,53 0 top
B4  29,17 180 top
B5  29,7 180 top
B6  62,18 180 top
B7  55,12 90 top
B8  62,12 180 top
B9  69,12 90 top
B10  62,6 180 top
B11  27,53 270 top
B12  64.5,70 180 top
C1  7,22 90 top
C2  62.5,60.25 0 top
C3  59,58 270 top
C4  50,54 270 top
C5  13.5,55 270 top
C6  13.5,45 90 top
C7  50,49 90 top
C8  50,44 270 top
C9  64,48 90 top
C11  70,43.5 270 top
C12  73.5,43.5 270 top
C13  66.5,60.5 270 top
C14  66.5,65.5 90 top
C15  76.5,65.5 90 top
C16  76.5,60.5 270 top
D1  19,8 270 top
D2  17,54 90 top
D3  19.5,46 270 top
D4  19,16 270 top
D5  76,8 270 top
D6  76,16 270 top
E1  43,12 0 top
E$1  [FRSKY-TARANIS-GIMBAL]  -40.5,40 0 top  (outside the outline)
E$2  [FRSKY-TARANIS-GIMBAL]  126.5,40 180 top  (outside the outline)
J1  33,66.5 180 top
J2  3,52.95 270 top
J3  83,35 90 top
J4  43,45 270 top
J7  36,33 90 top
J8  50,33 270 top
JP1  17,59.5 0 top
L1  43,44 0 top
P1  49,23 270 top
P2  37,23 270 top
P3  41,23 270 top
P4  45,23 270 top
R1  11,22 90 top
R2  3,22 90 top
R3  23,22 270 top
R7  9.5,55 90 top
R8  27,22 90 top
R13  77,22 90 top
R14  81,22 90 top
R15  15,22 270 top
R16  19,22 270 top
R17  69,22 270 top
R18  73,22 270 top
S1  4,12 90 top
S2  82,12 270 top
U2  13.5,50 0 top
U3  57,49 90 top
U4  71.5,52 0 top
U5  43,33 90 top
U$1  [LAYER_LABELS]  42.5,-3 0 top
U$4  [375MAH-BATTERY]  -3.12,55.5 0 top  (outside the outline)
U$5  [600MAH-BATTERY]  0,45 0 top
U$134  [QUADCLASS_LOGO]  18,85.5 0 top  (outside the outline)
V1  15.15,55.65 90 top
V2  19.15,55.65 90 top
V3  8.4,52.65 270 top
V4  8.4,46.65 90 top
V5  10.4,46.65 270 top
V6  15.15,45.65 90 top
V7  8.4,50.65 90 top
V8  10.4,52.65 90 top
V9  57.5,62.5 0 top
V10  19.5,46 0 top
V23  15.15,51.65 90 top
V24  19.15,51.65 90 top
V26  15.15,53.65 90 top
V27  17.15,53.65 90 top
V28  19.15,53.65 90 top
V30  17.15,45.65 90 top
V31  15.15,43.65 90 top
V32  17.15,43.65 90 top
V33  16.15,48.65 90 top
V34  17.15,47.65 90 top
V35  10.4,48.65 90 top
V36  15.15,47.65 90 top
V37  10.4,50.65 90 top
V38  8.4,48.65 90 top
Y1  71.5,61 180 top

### Tracks (layer width: path | path; a pad name or v marks a point on that pad's centre or on a via)
3V3  (via drill 0.2)
  Top 0.254: U3.17 v52.29,51.92 | U3.4 v61.71,46.73 | U5.16 v40.73,37.01 | C16.1 v76.5,62.46 | S2.1 v79.64,14.5 | JP1.VCC v15.73,62.08 | C9.1 v64,46.04 | D4.A2 v17.19,17.75 | C4.2 v50,52.04 | J4.2 v47.47,47.54 | R13.2 v77,24 | C12.1 v73.5,45.46 | R8.2 v27,24 | R2.2 v3,24 | R14.2 v81,24 | U4.34 77.75,48.75 78.5,49.5 78.5,52.75 77.5,53.75 U4.44 72.25,53.75 | v70.75,45.5 U4.23 | U4.59 70.25,56 70.5,55.75 72.25,55.75 | 72.25,55.75 72.5,55.75 72.75,56 U4.54 | 72.25,55.75 72.25,53.75 | 72.25,53.75 v72.25,48.75
  Route2 0.254: v70.75,45.5 70.75,47.25 v72.25,48.75
  pour Bottom (rank 2): 39.5,78.5 -4,78.5 -4,-1.5 89.99,-1.5 89.89,58 90,58 90,78.5 64,78.5 64,63 39.5,63
  pour Route15 (rank 2): -3,77.49 39.5,77.49 39.5,63 64,63 64,77.5 89,77.5 89,-0.5 -3,-0.5
ANTENNA
  Top 0.127: B2.1 61.2,57.94
  Top 1.27: A1.FEED C2.1 61.61,58.34 61.2,57.94
BCAP
  Top 0.254: B2.2 60.38,57 60.25,57.12 59,57.12 C3.2
BPOS  (via drill 0.38)
  Top 0.508: v22.05,51.75 B3.1B 27,51.75 B11.2 27.25,51.75 B3.1A v31.94,51.75 | D3.A v19.5,43.27
  Route15 0.508: V34.P1 17.75,48.25 17.75,48.5 19,49.75 20,49.75 22,51.75 v22.05,51.75
  pour Top: 13.9,48.65 13.9,42.65 20.65,42.65 20.65,49.5 14,49.5 14,48.75
  pour Bottom: 13.9,49.65 13.9,42.65 20.65,42.65 20.65,49.65
BTN1/SCL  (via drill 0.2)
  Top 0.127: U4.25 71.75,48 71.25,48.5 v70.25,48.5 | v45.75,24 43.5,24 39.75,20.25 37.5,20.25 32.75,15.5 B4.3
  Route15 0.127: v45.75,24 v54,32.25
  Bottom 0.127: v54,32.25 v70.25,48.5
BTN2/SDA  (via drill 0.2)
  Top 0.127: U4.26 72.25,45.25 71,44 v71,41.5 | v50,21.5 34,5.5 B5.3
  Bottom 0.127: v71,41.5 51,21.5 v50,21.5
BTN_CENTER  (via drill 0.2)
  Top 0.127: U4.53 73.25,55.5 v74.5,54.25 | v72,17.25 70.5,15.75 B9.2
  Bottom 0.127: v74.5,54.25 82.75,46 83.75,46 84.25,45.5 84.25,29.5 v72,17.25
BTN_DOWN  (via drill 0.2)
  Top 0.127: U4.28 73.25,46.25 73.5,46 73.75,46 74.75,45 v74.75,42.75 | v75.5,34.25 75.5,30.25 84.25,21.5 84.25,11.25 80.25,7.25 66,7.25 65.75,7.5 B10.1
  Bottom 0.127: v74.75,42.75 74.75,35 v75.5,34.25
BTN_LEFT  (via drill 0.2)
  Top 0.127: U4.51 74.25,57.75 74.5,58 v78.5,58 | v84.5,57.75 84.5,21.75 84.75,21.5 84.75,11.25 77,3.5 64.25,3.5 59.25,8.5 56.5,8.5 B7.1
  Bottom 0.127: v78.5,58 79.75,58 80,57.75 v84.5,57.75
BTN_RIGHT  (via drill 0.2)
  Top 0.127: U4.52 73.75,56 v75,54.75 | v72.5,16.75 72.5,15.75 70.25,13.5 B8.1
  Bottom 0.127: v75,54.75 77.5,52.25 77.5,52 81.5,48 83.75,48 84.75,47 84.75,29 v72.5,16.75
BTN_UP  (via drill 0.2)
  Top 0.127: U4.50 74.75,55.75 v75,55.5 | v59,32.5 59,26 65.5,19.5 B6.1
  Bottom 0.127: v75,55.5 74,54.5 74,53 76.25,50.75 76.25,47.5 73.25,44.5 71,44.5 v59,32.5
CLK_NEG
  Top 0.127: U4.56 71.75,60.55 Y1.1 75.81,64.61 C15.1
CLK_POS
  Top 0.127: C14.1 68.5,62.61 68.5,60.8 69.45,59.85 Y1.3 71.25,58.25 U4.57
CTS  (via drill 0.2)
  Top 0.127: v52.25,44.25 54.25,44.25 55,45 55,46.25 60,51.25 60.5,51.25 U3.11 | v44.5,38 43.5,38 42.75,38.75 41.75,38.75 40.25,37.25 40.25,33.5 41.25,32.5 41.25,30.25 U5.2
  Bottom 0.127: v52.25,44.25 50.75,42.75 49.25,42.75 v44.5,38
CTS-1  (via drill 0.2)
  Top 0.127: v39.25,37.5 39.25,34 40.75,32.5 40.75,30.25 U5.1 | v20.25,57.75 18,57.75 17.5,58.25 15,58.25 13.25,60 JP1.CTS
  Bottom 0.127: v39.25,37.5 23,53.75 23,55 v20.25,57.75
DTR  (via drill 0.2)
  Top 0.127: v53.25,43.25 54.25,43.25 56.5,45.5 60.5,45.5 U3.2 | v44.5,37.25 43.75,37.25 42.75,38.25 42.25,38.25 42,38 42,36 U5.14
  Bottom 0.127: v53.25,43.25 46.75,36.75 45,36.75 v44.5,37.25
DTR-0  (via drill 0.2)
  Top 0.127: v37.25,30.25 37,30 28.75,30 22,23.25 22,22.5 22.25,22.25 23.25,22.25 24,21.5 24,20.75 23.5,20.25 21.5,20.25 20,21.75 10.75,21.75 9.75,22.75 7,22.75 C1.2 | v40.75,33.75 40.75,34.5 41.25,35 41.25,35.75 U5.15
  Bottom 0.127: v40.75,33.75 v37.25,30.25
DTR-1  (via drill 0.2)
  Top 0.127: v42.5,37.75 42.5,36 U5.13 | v28,58.25 25.25,58.25 23.5,60 JP1.DTR
  Bottom 0.127: v42.5,37.75 42.5,42.5 28,57 v28,58.25
E1-A  (via drill 0.2)
  Top 0.127: U4.40 74.25,51.75 73,50.5 v73,48.75 | v66.5,35 v66.5,42.25
  Bottom 0.127: v66.5,42.25 v73,48.75 | v66.5,35 66.5,32.5 41.5,7.5 41.5,5.5 E1.A
E1-B  (via drill 0.2)
  Top 0.127: v78,52.25 U4.41 | v85,49 85,21.75 85.25,21.5 85.25,11.25 77,3 47,3 E1.B
  Bottom 0.127: v78,52.25 80,52.25 82.25,50 84,50 v85,49
E1-BUT  (via drill 0.2)
  Top 0.127: U4.27 72.75,45.25 71.5,44 v71.5,43.5
  Bottom 0.127: v71.5,43.5 70.25,42.25 70,42.25 48.25,20.5 42.5,20.5 41,19 E1.BUTA
GND  (via drill 0.2, 0.38)
  Top 0.127: C12.2 v73.5,41.54 | J4.6 v47.47,42.46 | C4.1 v50,55.96 | U4.45 v77.52,54.25 | U4.35 v77.52,49.25 | U4.33 v77.52,48.25 | U4.20 v69.25,45.98 | U4.24 v71.25,45.98 | U4.61 v69.25,58.02 | U4.58 v70.75,58.02 | U4.55 v72.25,58.02 | C9.2 v64,49.96 | C7.2 v50,50.96 | U3.26 v52.29,46.08 | U3.25 v51.67,46.73 | U3.21 v52.29,49.33 | U3.7 v61.71,48.67 | B3.2B v22.14,54.25 | B3.2A v31.86,54.25 | J1.5 v31.7,65.47 | S2.3 v79.64,9.5 | C6.2 v13.5,46.96 | R18.1 v73,24 | R15.1 v15,24 | J7.3 v33.42,31.73 | J7.6 v33.42,39.35 | R16.1 v19,24 | B8.4 v57.24,10.5 | B8.3 v66.76,10.5 | B10.4 v57.24,4.5 | B10.3 v66.76,4.5 | B1.3 v8.34,8.4 | B1.4 v8.34,15.6 | B5.2 v24.24,8.5 | B5.1 v33.76,8.5 | U2.2 v13.5,47.74 | C5.2 v13.5,53.04 | C15.2 v76.5,67.46 | R17.1 v69,24 | C11.2 v70,41.54 | C14.2 v66.5,67.46 | C8.2 v50,42.04 | C13.2 v66.5,58.54 | C16.2 v76.5,58.54 | U5.8 v45.27,28.99 | B7.3 v52.34,8.4 | B7.4 v52.34,15.6 | D1.C1 v20.81,6.25 | J8.3 v52.58,34.27 | J8.6 v52.58,26.65 | R7.2 v9.5,57 | B4.2 v24.24,18.5 | B4.1 v33.76,18.5 | JP1.GND v10.65,62.08 | v49,59 49.66,58.34 L1.GND2
  Route2 0.127: v50,55.96 50,58 v49,59
  pour Bottom: 13.27,42.65 13.27,56.15 7.15,56.15 7.15,42.65
  pour Top (rank 2): 39.5,77 -2.5,77 -2.5,0 88.5,0 88.5,77 64,77 64,63 39.5,63
  pour Route2: 68,53 68,50.5 64.5,50.5 57,58 57,63 65.5,63 65.5,53
  pour Route15: 68,53 68,50.5 64.5,50.5 57,58 57,63 65.5,63 65.5,53
  pour Bottom: 68,53 68,50.5 64.5,50.5 57,58 57,63 65.5,63 65.5,53
  pour Route2: -3.5,78 39.5,78 39.5,63 64,63 64,78 89.5,78 89.5,-1 -3.5,-1
GREF  (via drill 0.2)
  Top 0.127: J3.1 83,33.75 82,34.75 | 82,34.75 82,38 J3.4 | J8.1 50.5,39.25 48.75,37.5 48.75,33.5 50.5,31.75 J8.4 50.75,31.75 52,33 v52.5,33 | 82,34.75 75.25,34.75 73.5,33 v54,33 | J2.1 3,54.75 2,53.75 2,50.5 3,49.5 J2.4 3,48.25 7,44.25 7,42.5 15,34.5 35.25,34.5 J7.4 35.5,34.25 37.75,32 37.75,28 | R8.1 27,21.25 30,21.25 35.25,26.5 J7.1 35.5,26.75 36.5,26.75 37.75,28 | v47.25,32.25 47.25,29.75 45.5,28 37.75,28
  Bottom 0.127: v54,33 v52.5,33 49.75,33 49,32.25 v47.25,32.25
LCD_RX  (via drill 0.2)
  Top 0.127: v55,55 52.5,57.5 40.25,57.5 38.5,59.25 38.5,61.5 L1.RXI | v75.75,47.75 75.25,47.25 U4.32
  Bottom 0.127: v55,55 59.25,55 63.5,50.75 63.75,51 64.75,50 67.75,50 69.5,51.75 74.75,51.75 75.75,50.75 v75.75,47.75
LCD_TX  (via drill 0.2)
  Top 0.127: v62.75,50.25 62.75,52.5 61.5,53.75 60.75,53.75 52,62.5 48,62.5 44,58.5 41,58.5 L1.TX0 | v74.5,49.75 74.5,48.25 74.75,48 U4.31
  Bottom 0.127: v62.75,50.25 63.75,49.25 67.5,49.25 68.25,50 74.25,50 v74.5,49.75
MISO  (via drill 0.2)
  Top 0.127: v74.5,51.25 U4.39 | v42.75,48 40.75,48 40.5,47.75 J4.1
  Bottom 0.127: v74.5,51.25 74.5,50.5 75,50 75,49.5 74.75,49.25 69,49.25 67,47.25 54.5,47.25 52.5,45.25 45.5,45.25 v42.75,48
MOSI  (via drill 0.2)
  Top 0.127: U4.38 74.75,50.75 73.5,49.5 73.5,48.5 73.25,48.25 72,48.25 71.25,49 v68,49 | v49,47.25 48,47.25 45.75,45 J4.4
  Bottom 0.127: v68,49 66.75,47.75 49.5,47.75 v49,47.25
N$1  (via drill 0.2)
  Top 0.127: v23.25,13 23.25,18.25 24.5,19.5 24.5,21.5 23.25,22.75 23,22.75 R3.1 | v21,10.75 20,9.75 D1.A1
  Bottom 0.127: v21,10.75 v23.25,13
N$2  (via drill 0.2)
  Top 0.127: R1.1 11,19 13.5,16.5 v13.5,12.75 | v13.5,11.25 18.5,6.25 D1.C2
  Bottom 0.127: v13.5,11.25 v13.5,12.75
N$3
  Top 0.127: R14.1 81,16.5 76.75,12.25 76.75,9.75 D5.A1
N$4
  Top 0.127: R17.2 69,21 75.25,14.75 75.25,14.25 D6.C2
N$6
  Top 0.127: R15.2 15,16 17.75,13.25 19,13.25 19.5,13.75 19.5,14.25 D4.C1
N$8  (via drill 0.2)
  Top 0.127: D6.A2 74.5,17.75 71.25,21 v71.25,32.5 | v71.25,34 71.25,38.5 65,44.75 65,48.5 65.75,49.25 U4.14
  Bottom 0.127: v71.25,34 v71.25,32.5
N$9  (via drill 0.2)
  Top 0.127: v72,32.5 72,20.75 72.5,20.25 74.5,20.25 76.5,18.25 76.5,17.75 D6.A1 | v72,34 72,38.25 65.5,44.75 65.5,48.5 65.75,48.75 U4.15
  Bottom 0.127: v72,34 v72,32.5
N$11
  Top 0.127: U2.1 12.5,48.75 12.5,49.75 7.5,54.75 7.5,56.5 7.25,56.75 3,56.75 1.5,55.25 1.5,35 2.5,34 3.25,34 11,26.25 R1.2 11,22.75 11.5,22.25 20,22.25 21,21.25 23,21.25 R3.2
N$12
  Top 0.127: U2.5 12.5,51.5 10,54 9.5,54 R7.1
N$13
  Top 0.127: R16.2 19,14.75 18.5,14.25 D4.C2
N$14
  Top 0.127: R13.1 77,19.5 78,18.5 78,14 75.5,11.5 75.5,9.75 D5.A2
N$20
  Top 0.127: 70,46 C11.1 | 70,46 69.75,46.25 U4.21 | U4.22 70.25,46.25 70,46
N$21
  Top 0.127: U4.60 69.75,58.25 69.5,58.5 69,58.5 68.5,59 68.5,59.25 66.5,61.25 C13.1
N$30
  Top 0.127: R18.2 73,21 75,21 77.5,18.5 77.5,15 76.75,14.25 D6.C1
PITCH  (via drill 0.2)
  Top 0.127: U4.2 65.75,55.25 64.5,56.5 64.5,66.75 66.25,68.5 76.75,68.5 84,61.25 84,36 J3.V | v52.5,30 51.75,29.25 50.75,29.25 J8.V
  Bottom 0.127: v52.5,30 57.25,30 71.25,44 74.25,44 83,35.25 J3.V
PROG_SEL  (via drill 0.2)
  Top 0.127: 42.75,32.75 42.75,34.5 43.25,35 43.25,35.75 U5.12 | 42.75,32.75 42.75,30.25 U5.4 | S2.2 80.5,12 77.25,8.75 72,8.75 68.25,12.5 64.75,12.5 63,14.25 63,20.5 v55.25,28.25 | 42.75,32.75 v45,32.75
  Bottom 0.127: v55.25,28.25 54,29.5 48.25,29.5 v45,32.75
RESET  (via drill 0.2)
  Top 0.127: 7,21 3,21 R2.1 | 7,21 12.5,15.5 B1.2 | 7,21 C1.1 | U4.12 64.5,50.25 64.25,50.5 63.75,50.5 62.25,49 62.25,45 58.25,41 v54,41 | v47.25,35.75 46.75,36.25 46.75,36.5 41,42.25 40.5,42.25 J4.5 | v48.75,32.75 48.75,26 50.5,24.25 50.5,21.25 33.75,4.5 18.5,4.5 14.75,8.25 12.5,8.25 B1.1
  Bottom 0.127: 48.75,35.75 v54,41 | v47.25,35.75 48.75,35.75 | 48.75,35.75 v48.75,32.75
RF  (via drill 0.2)
  Top 0.127: D4.A1 22,17.75 v24,19.75 | v66,45 66,47.75 66.5,48.25 U4.16
  Bottom 0.127: v24,19.75 31.25,19.75 45,33.5 46,33.5 46.25,33.75 46.25,34.75 44,37 44,38.25 47.5,41.75 47.75,41.75 50.75,44.75 65.75,44.75 v66,45
RF_N
  Top 0.127: U4.9 65.39,51.75 61.2,55.94 B2.3
RF_P
  Top 0.127: U4.8 65.25,52.25 62,55.5 62,55.55 B2.4
ROLL  (via drill 0.2)
  Top 0.127: 82,42 82,62.75 76.75,68 66.25,68 65,66.75 65,58.75 66.5,57.25 66.5,55.75 U4.1 | J3.H 82,42 | v52.5,36 51.75,36.75 50.75,36.75 J8.H | v54,36 64.75,36 67.25,33.5 73.5,33.5 82,42
  Bottom 0.127: v54,36 v52.5,36
RXI  (via drill 0.2)
  Top 0.127: v52.75,43.75 54.25,43.75 57.75,47.25 60.5,47.25 U3.5 | v45.25,37.25 44.75,36.75 44.75,36 U5.10
  Bottom 0.127: v52.75,43.75 46.25,37.25 v45.25,37.25
RXI-0  (via drill 0.2)
  Top 0.127: U4.47 78.25,55.25 78.5,55 v78.5,53.5 | v45.75,34 45,34 44,35 44,35.75 U5.11
  Route15 0.127: v78.5,53.5 78.5,50.25 78,49.75 77.5,49.75 77.25,50 76.25,50 62.75,36.5 47.25,36.5 45.75,35 v45.75,34
RXI-1  (via drill 0.2)
  Top 0.127: v45.25,34.5 45.25,35.75 U5.9 | v24.5,58.25 22.75,58.25 21,60 JP1.RXI
  Bottom 0.127: v45.25,34.5 42.5,37.25 42.25,37.25 28.5,51 28.5,55.25 25.5,58.25 v24.5,58.25
RXLED  (via drill 0.2)
  Top 0.127: v54.5,45.25 54.5,48.25 54,48.75 53.5,48.75 U3.22 | v55,32.5 55,28.75 54.75,28.5 54.75,25 62.5,17.25 62.5,8.75 65,6.25 D5.C2
  Route2 0.127: v54.5,45.25 54.5,33 v55,32.5
SCK  (via drill 0.2)
  Top 0.127: v77.75,50.25 U4.37 | v42.75,47.25 40.5,45 J4.3
  Route15 0.127: v77.75,50.25 77.5,50.5 68.75,50.5 66.25,48 43.5,48 v42.75,47.25
THROTTLE  (via drill 0.2)
  Top 0.127: v67.25,43.75 67.25,43.5 69.75,41 73.75,41 79,46.25 79,63.5 77,65.5 66,65.5 65.5,65 65.5,58.75 67.25,57 67.75,57 U4.64 | v46.75,31.75 46.75,29.75 45.5,28.5 40.5,28.5 38.25,30.75 38.25,34 35.5,36.75 J7.V 35.25,36.75 29.75,42.25 v8,42.25
  Bottom 0.127: v67.25,43.75 55.25,31.75 v46.75,31.75 | v8,42.25 7.75,42.5 7,42.5 7,48.75 3,52.75 J2.V
TXLED  (via drill 0.2)
  Top 0.127: v54,41.75 51,44.75 51,46.75 52.25,48 53.25,48 U3.23 | v54,31.25 54,22 58.5,17.5 59.25,17.5 62,14.75 62,8.75 65.25,5.5 74.5,5.5 74.75,5.25 76,5.25 76.5,5.75 76.5,6.25 D5.C1
  Route2 0.127: v54,41.75 53.5,41.25 53.5,31.75 v54,31.25
TXO  (via drill 0.2)
  Top 0.127: v53.75,42.75 54.25,42.75 56.25,44.75 60.5,44.75 U3.1 | v46.25,36.25 46.25,33.25 44,31 44,30.25 U5.6
  Bottom 0.127: v53.75,42.75 47.25,36.25 v46.25,36.25
TXO-0  (via drill 0.2)
  Top 0.127: v78,54.75 U4.46 | v47.25,35 47.25,33.5 44.75,31 44.75,30.25 U5.7
  Route15 0.127: v78,54.75 79,53.75 79,48.75 65.25,35 v47.25,35
TXO-1  (via drill 0.2)
  Top 0.127: v39.5,52.5 38.5,51.5 38.5,42 38.75,41.75 38.75,30.75 40.5,29 43,29 43.25,29.25 43.25,30 U5.5 | v40.5,53.5 40.5,55 34.75,60.75 25.25,60.75 24,62 20.25,62 18.5,60.25 JP1.TXO
  Bottom 0.127: v40.5,53.5 v39.5,52.5
USB_D_N
  Top 0.127: J1.2 33.65,63.35 40,57 52.36,57 55.25,54.11 55.25,53.89 53.93,52.58 U3.16
USB_D_P
  Top 0.127: J1.3 33,63.64 39.9,56.75 52.25,56.75 55,54 54.23,53.23 U3.15
VBAT  (via drill 0.38)
  Top 0.508: S1.2 v2.8,10.76 | v19.5,48.73 D3.C 19.5,47.5 19,47.5 18.25,46.75 | v17,51.27 D2.C 17.25,52.25 18,52.25 | V10.P1 18.75,46 18.25,46.5 18.25,46.75 | 18,52.25 18.5,51.75 18.5,49.5 18,49 18,47.25 18.25,47 18.25,46.75 | S1.2 19,12 19.25,12.25 24.25,12.25 35,23 P2.T | 18,52.25 18.25,52.25 18.5,52.5 18.5,56.5 17.25,57.75 3.25,57.75 1,55.5 1,14 2.75,12.25 S1.2
VBUS  (via drill 0.38)
  Top 0.508: v17.11,9.75 D1.A2 18.25,10 18.75,10.5 18.75,10.75 19.5,11.5 34.5,11.5 40.5,17.5 42,17.5 47.5,23 48,23 | C5.1 v13.5,57.05 | J1.1 v34.3,65.38 | U2.4 v14.45,52.34 | P1.T 48,23 | 20.25,56.15 20.25,56.75 21,57.5 28.25,57.5 30.25,59.5 33,59.5 37.25,55.25 37.75,55.25 43.5,49.5 43.5,40.5 48,36 48,23
  Bottom 0.508: v34.3,65.38 34.25,65.25 28,59 15.25,59 13.5,57.25 v13.5,57.05
  pour Top: 13.9,51.35 13.9,56.15 20.65,56.15 20.65,50.5 14,50.5 14,51.25
  pour Bottom: 13.9,50.35 13.9,56.15 20.65,56.15 20.65,50.35
VREG_IN  (via drill 0.38)
  Top 0.508: S1.1 v6.44,9.5 6.5,9.25 11.75,4 34,4 53.25,23.25 53.25,41.5 50,44.75 C8.1 v50,46.05 v50,46.95 C7.1 50,48.25 51.75,50 53.25,50 U3.20 53.5,50 54.25,50 55.75,51.5 55.75,55.25 49.5,61.5 48.5,61.5 L1.RAW
YAW  (via drill 0.2)
  Top 0.127: U4.63 68.25,49.75 v68.5,49.5 | v37.25,28.25 36.25,28.25 35.5,29 J7.H | J2.H 3,46.25 6.5,42.75 6.5,42.5 18.5,30.5 v35,30.5
  Route15 0.127: v68.5,49.5 68.5,48.75 56.75,37 46,37 v37.25,28.25
  Bottom 0.127: v37.25,28.25 v35,30.5

### Text on the board
Top: add notch to help with docking to test stand
tPlace: BLK | GRN | Ignore four drills outside of board area | Ignore four drills outside of board area | Steven / Swanson | VBAT | 3V3 | GND | VBUS | OFF | RST | RC | PWR | RX/TX | STATUS | BTN1 | CHARGING | COMPLETE | FTDI | ON | QUAD | BTN2 | Mark IV | Rev 6 | CSE176e Remote
Document: Mounting w/o LCD: / 1.6mm controller board / 9mm standoff (3x donuts) / 3mm baseplate / 1.6mm runout / 15.2mm total / ~5/8in total | Mounting w/ LCD: / 1.6mm LCD / 12mm standoff (4x) / 1.6mm controller board / 9mm standoff (3x donuts) / 3mm baseplate / 1.6mm nut / 28.8 mm total / ~1 1/4 in | Mounting gimbals: / 1in standoffs.
baseplateart: To achieve great things, two things are needed: a plan and not quite enough time. --Leonard Bernstein | CSE176e | <--THROTTLE--> | <--PITCH--> | <--YAW--> | <--ROLL-->